# Altium schematic sheet Power.SchDoc
size A
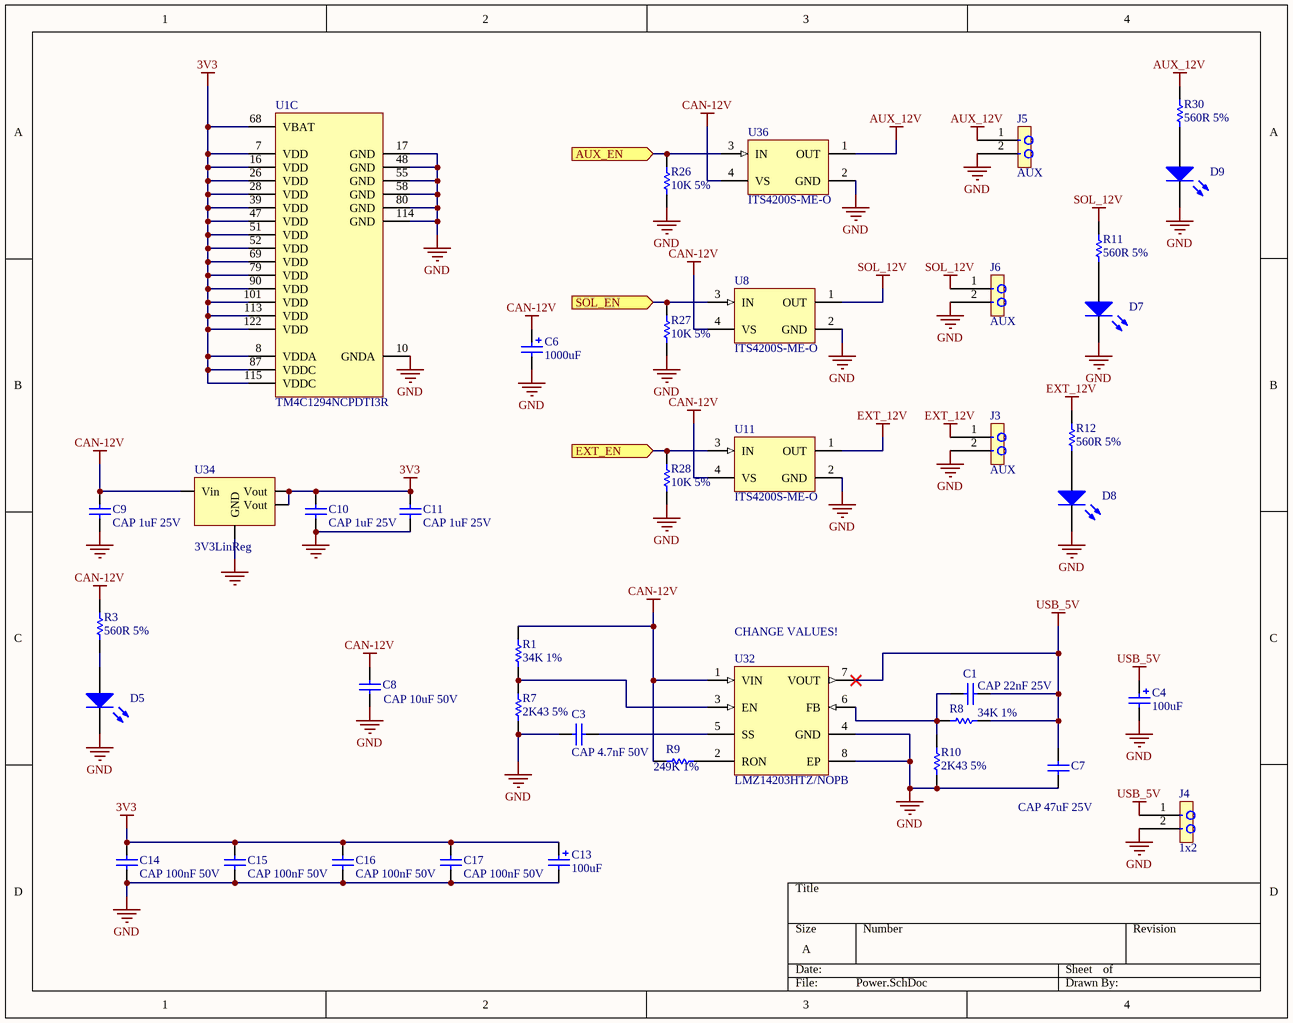
[diagram p0: Power.SchDoc]

## Parts
C1  CAP 22nF 25V  [CAPC0805(2012)100_M]
C3  CAP 4.7nF 50V  [CAPC0603(1608)100_M]
C4  100uF  [PANASONIC_C]
C6  1000uF  [PANASONIC_H13]
C7  CAP 47uF 25V  [CAPC1206(3216)100_L]
C8  CAP 10uF 50V  [CAPC1206(3216)190_M]
C9  CAP 1uF 25V  [CAPC0603(1608)100_M]
C10  CAP 1uF 25V  [CAPC0603(1608)100_M]
C11  CAP 1uF 25V  [CAPC0603(1608)100_M]
C13  100uF  [PANASONIC_C]
C14  CAP 100nF 50V  [CAPC0603(1608)100_M]
C15  CAP 100nF 50V  [CAPC0603(1608)100_M]
C16  CAP 100nF 50V  [CAPC0603(1608)100_M]
C17  CAP 100nF 50V  [CAPC0603(1608)100_M]
D5  LED  [LED-0603]  (value not drawn)
D7  LED  [LED-0603]  (value not drawn)
D8  LED  [LED-0603]  (value not drawn)
D9  LED  [LED-0603]  (value not drawn)
J3  AUX  [M5569-2]
J4  1x2  [1X2]
J5  AUX  [M5569-2]
J6  AUX  [M5569-2]
R1  34K 1%  [RESC0603(1608)_M]
R3  560R 5%  [RESC0603(1608)_M]
R7  2K43 5%  [RESC0603(1608)_M]
R8  34K 1%  [RESC0603(1608)_M]
R9  249K 1%  [RESC0603(1608)_M]
R10  2K43 5%  [RESC0603(1608)_M]
R11  560R 5%  [RESC0603(1608)_M]
R12  560R 5%  [RESC0603(1608)_M]
R26  10K 5%  [RESC0603(1608)_N]
R27  10K 5%  [RESC0603(1608)_N]
R28  10K 5%  [RESC0603(1608)_N]
R30  560R 5%  [RESC0603(1608)_M]
U1  TM4C1294NCPDTI3R  [TI-PDT128_M]  (part C of 3)
U8  ITS4200S-ME-O  [INF-SOT223_M]
U11  ITS4200S-ME-O  [INF-SOT223_M]
U32  LMZ14203HTZ/NOPB  [TZA07A_V]
U34  3V3LinReg  [SOT-223]
U36  ITS4200S-ME-O  [INF-SOT223_M]

## Ports
AUX_EN (in), EXT_EN (in), SOL_EN (in)

## Nets
3V3: C10.2 C11.2 C13.+ C14.2 C15.2 C16.2 C17.2 U1.7(VDD) U1.8(VDDA) U1.16(VDD) U1.26(VDD) U1.28(VDD) U1.39(VDD) U1.47(VDD) U1.51(VDD) U1.52(VDD) U1.68(VBAT) U1.69(VDD) U1.79(VDD) U1.87(VDDC) U1.90(VDD) U1.101(VDD) U1.113(VDD) U1.115(VDDC) U1.122(VDD) U34.2(Vout) U34.4(Vout)
AUX_12V: J5.1 R30.2 U36.1(OUT)
CAN-12V: C6.+ C8.1 C9.2 R1.2 R3.2 R9.1 U8.4(VS) U11.4(VS) U32.1(VIN) U34.3(Vin) U36.4(VS)
EXT_12V: J3.1 R12.2 U11.1(OUT)
GND: C3.1 C4.- C6.- C7.2 C8.2 C9.1 C10.1 C11.1 C13.- C14.1 C15.1 C16.1 C17.1 D5.2(K) D7.2(K) D8.2(K) D9.2(K) J3.2 J4.2 J5.2 J6.2 R7.1 R10.1 R26.1 R27.1 R28.1 U1.10(GNDA) U1.17(GND) U1.48(GND) U1.55(GND) U1.58(GND) U1.80(GND) U1.114(GND) U8.2(GND) U11.2(GND) U32.4(GND) U32.8(EP) U34.1(GND) U36.2(GND)
SOL_12V: J6.1 R11.2 U8.1(OUT)
USB_5V: C1.2 C4.+ C7.1 J4.1 R8.2 U32.7(VOUT)
AUX_EN: R26.2 U36.3(IN) ; port AUX_EN
EXT_EN: R28.2 U11.3(IN) ; port EXT_EN
SOL_EN: R27.2 U8.3(IN) ; port SOL_EN
NetC1_1: C1.1 R8.1 R10.2 U32.6(FB)
NetC3_2: C3.2 U32.5(SS)
NetD5_1: D5.1(A) R3.1
NetD7_1: D7.1(A) R11.1
NetD8_1: D8.1(A) R12.1
NetD9_1: D9.1(A) R30.1
NetR1_1: R1.1 R7.2 U32.3(EN)
NetR9_2: R9.2 U32.2(RON)

## Notes on the sheet
- (near U32) CHANGE VALUES!

## Library data of the parts
C1 = CMP-1036-04051-1: CAP 22nF 25V Â±5% 0805 (2012 Metric) Thickness 1mm SMD; Case-Metric: 2012; Case-EIA: 0805; Technology: SMT; Max Thickness: 1 mm; Value: 22nF; Rated Voltage: 25 V; Tolerance: Â±5%
C3 = CMP-1035-00333-1: CAP 4.7nF 50V Â±20% 0603 (1608 Metric) Thickness 1mm SMD; Case-EIA: 0603; Case-Metric: 1608; Max Thickness: 1 mm; Rated Voltage: 50 V; Technology: SMT; Tolerance: Â±20%; Value: 4.7nF
C4 C13 = Cap_Polarized_100uF: Polarized Capacitor (Surface Mount); Published: 8-Jun-2000; LatestRevisionDate: 29-May-2009; LatestRevisionNote: IPC-7351 Footprint Added.; PackageReference: C0805; Publisher: Altium Limited; PackageDescription: Chip Capacitor; Value: 100uF; Supplier 1: Digi-Key; Supplier 2: Mouser; Supplier Part Number 1: PCE4718CT-ND; Supplier Part Number 2: 667-EEE-HAJ101WAR
C6 = Cap_Polarized_1000uF: Polarized Capacitor (Surface Mount); Published: 8-Jun-2000; LatestRevisionDate: 29-May-2009; LatestRevisionNote: IPC-7351 Footprint Added.; PackageReference: C0805; Publisher: Altium Limited; PackageDescription: Chip Capacitor; Value: 1000uF; Supplier 1: Digi-Key; Supplier 2: Mouser; Supplier Part Number 1: PCE3462CT-ND; Supplier Part Number 2: 140-VE102M1ETR1313
C7 = CMP-1037-00376-1: CAP 47uF 25V Â±0.25pF 1206 (3216 Metric) Thickness 1mm SMD; Case-EIA: 1206; Case-Metric: 3216; Technology: SMT; Max Thickness: 1 mm; Value: 47uF; Tolerance: Â±0.25pF; Rated Voltage: 25 V
C8 = CMP-1037-04982-1: CAP 10uF 50V Â±10% 1206 (3216 Metric) Thickness 1.9mm SMD; Case-EIA: 1206; Case-Metric: 3216; Technology: SMT; Tolerance: Â±10%; Max Thickness: 1.9 mm; Value: 10uF; Rated Voltage: 50 V
C9-C11 = CMP-1035-00037-1: CAP 1uF 25V Â±0.25pF 0603 (1608 Metric) Thickness 1mm SMD; Case-Metric: 1608; Case-EIA: 0603; Tolerance: Â±0.25pF; Max Thickness: 1 mm; Value: 1uF; Technology: SMT; Rated Voltage: 25 V
C14-C17 = CMP-1035-00010-1: CAP 100nF 50V Â±0.1pF 0603 (1608 Metric) Thickness 1mm SMD; Case-Metric: 1608; Case-EIA: 0603; Tolerance: Â±0.1pF; Technology: SMT; Value: 100nF; Max Thickness: 1 mm; Rated Voltage: 50 V
D5 D7-D9 = LED: Typical RED, GREEN, YELLOW, AMBER GaAs LED; Published: 8-Jun-2000; LatestRevisionDate: 17-Jul-2002; LatestRevisionNote: Re-released for DXP Platform.; PackageVersion: Feb-2002; PackageReference: 3.2X1.6X1.1; Publisher: Altium Limited; PackageDescription: SM LED; 2 Flat Leads; Supplier 1: Digi-Key; Supplier 2: Mouser; Supplier Part Number 1: 475-1409-1-ND; Supplier Part Number 2: 720-LGQ971-KN-1
J3-J6 = CON2: 6.35mm right-angle 90° male spade terminal PCB mount; CID: 643; CID2: 643; CID3: 643
R1 R8 = CMP-1012-00682-1: 34K 0.1W 1% 0603 (1608 Metric)  SMD; Value: 34000.00 Ohm; Case-EIA: 0603; Case-Metric: 1608; Tolerance: 1 %; Power: 0.1 W; Technology: SMT
R3 R11 R12 R30 = CMP-1012-00068-1: 560R 0.1W 5% 0603 (1608 Metric)  SMD; Case-EIA: 0603; Case-Metric: 1608; Value: 560.00 Ohm; Tolerance: 5 %; Technology: SMT; Power: 0.1 W
R7 R10 = CMP-1012-00083-1: 2K43 0.1W 5% 0603 (1608 Metric)  SMD; Value: 2430.00 Ohm; Case-Metric: 1608; Case-EIA: 0603; Tolerance: 5 %; Technology: SMT; Power: 0.1 W
R9 = CMP-1012-00779-1: 249K 0.1W 1% 0603 (1608 Metric)  SMD; Case-Metric: 1608; Case-EIA: 0603; Value: 249000.00 Ohm; Technology: SMT; Power: 0.1 W; Tolerance: 1 %
R26-R28 = CMP-1012-00098-1: 10K 0.1W 5% 0603 (1608 Metric)  SMD; Case-EIA: 0603; Value: 10000.00 Ohm; Case-Metric: 1608; Technology: SMT; Tolerance: 5 %; Power: 0.1 W
U1 = CMP-0945-00007-1: Tiva C Series Microcontroller, 1024 KB Flash, 256 KB SRAM, 12 Bit, 20 Channels, -40 to 85 degC, 128-Pin TQFP (PDT), Green (RoHS & no Sb/Br), Tape and Reel; Manufacturer: Texas Instruments; SRAM: 256 KB; ADC Resolution: 12 Bits; ADC Channels: 20; Flash: 1024 KB; Max Speed: 120 MHz; CPU: ARM Cortex-M4; Packing: Tape and Reel; Mounting Technology: Surface Mount; Eco-Plan: Green (RoHS & no Sb/Br); ComponentLink1URL: http://www.ti.com/; ComponentLink3Description: Package Specification; ComponentLink2Description: Datasheet; PartNumber: TM4C1294NCPDTI3R; DatasheetVersion: 15863.2743; ComponentLink1Description: Manufacturer URL; ComponentLink3URL: http://www.ti.com/lit/ml/mpqf013/mpqf013.pdf; Temperature Range: -40 to 85 degC; ComponentLink2URL: http://www.ti.com/lit/ds/symlink/tm4c1294ncpdt.pdf; PackageVersion: 4087726/A; PackageDescription: 128-Pin Thin Quad Flat Package, Body 14 x 14 mm, Pitch 0.4 mm; PartId: 2
U8 U11 U36 = CMP-1095-00143-1: Smart High-Side NMOS-Power Switch, 11 to 45 V Operating, -40 to 125 degC, SOT223, Reel, Green; Manufacturer: Infineon; Channels: 1; IL (nom)min - one channel active: 0.7Â A; Green: TRUE; Operating Voltage Range (min): 11 V; RON (max) @ Tj max: 320 mOhm; Operating Voltage Range (max): 45 V; Ptot (max): 1.4Â W; toff (max): 150 us; RON @ 25 degC: 200 mOhm (max); IL (SCp): 1.4Â A; IL (SC): 1.1Â A; ton (max): 100 us; Packing: Reel; IL (nom)min - all channels active: 0.7Â A; ComponentLink2Description: Datasheet; Load Current (typ): 0.7Â A; ComponentLink1Description: Manufacturer URL; PackageDescription: 4-Pin Small Outline Transistor Package, 6.5 x 3.5 mm Body, 2.3 mm Pitch; Mounting Technology: Surface Mount; ComponentLink1URL: http://www.infineon.com/; ComponentLink2URL: http://www.infineon.com/dgdl/ITS4200S-ME-O_01092012S.pdf?folderId=db3a304412b407950112b408e8c90004&fileId=db3a304339dcf4b1013a013fb7455740; ComponentLink3URL: http://www.infineon.com/dgdl/SOT223-Package_Overview.pdf?folderId=db3a30431936bc4b0119530470b03c3d&fileId=db3a30431936bc4b0119531d40b93c5c; PackageReference: SOT223; ComponentLink3Description: Package Specification; PartNumber: ITS4200S-ME-O; DatasheetVersion: Rev. 1.0; PackageVersion: Apr-08
U32 = CMP-0069-02044-1: 3A SIMPLE SWITCHERÂ® Power Module with 42V Maximum Input for High Voltage Output, 7-pin TO-PMOD, Pb-Free, 250 Reel; Manufacturer: National Semiconductor; PowerWise: Y; PackageTopMarking: NSUZXYTTE#*LMZ14203*HTZ; ComponentLink3URL: http://www.national.com/packaging/folders/tza07a.html; ComponentLink2URL: http://www.national.com/pf/LM/LMZ14203H.html; ComponentLink1Description: LMZ14203 Datasheet; PackageVersion: revD, Apr-2011; RoHS: Y; DatasheetVersion: Jan-2011; PinCount: 7; CompType: Switcher; PackageDescription: TO-PMOD-7, 10.16 x 9.85 x 4.57 mm Body, 7 Lead, 1.27mm Pitch, Surface Mount; PackageReference: TZA07A; ComponentLink1URL: http://www.national.com/ds/LM/LMZ14203H.pdf; ComponentLink3Description: TZA07A Package Page; ComponentLink2Description: LMZ14203H Web Page
U34 = AZ1117EH: Reg 1A 3V3 OUT SIP VERT; Supplier 1: Digi-Key; Supplier Part Number 1: AZ1117EH-3.3TRG1DICT-ND